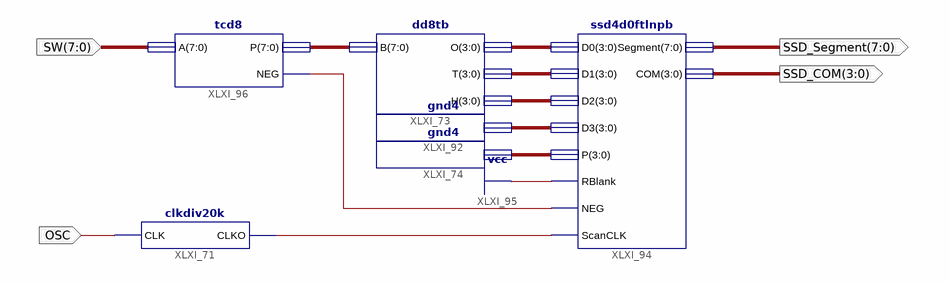
[diagram p0: schematic sheet 1]
// Xilinx ISE schematic main.sch (spartan6) as structural Verilog: 6 symbols, 4 ports
module main (
  input  OSC,
  input  [7:0] SW,
  output [3:0] SSD_COM,
  output [7:0] SSD_Segment
);

  wire XLXN_23, XLXN_28;
  wire [3:0] XLXN_1, XLXN_2, XLXN_3, XLXN_4, XLXN_5;
  wire [7:0] XLXN_27;

  dd8tb XLXI_73 (.B(XLXN_27), .H(XLXN_3), .O(XLXN_5), .T(XLXN_4));
  clkdiv20k XLXI_71 (.CLK(OSC), .CLKO(XLXN_23));
  gnd4 XLXI_74 (.GND(XLXN_2));
  gnd4 XLXI_92 (.GND(XLXN_1));
  ssd4d0ftlnpb XLXI_94 (
    .COM(SSD_COM), .D0(XLXN_5), .D1(XLXN_4), .D2(XLXN_3), .D3(XLXN_1), .NEG(XLXN_28), .P(XLXN_2),
    .RBlank(1'b1), .ScanCLK(XLXN_23), .Segment(SSD_Segment));
  tcd8 XLXI_96 (.A(SW), .NEG(XLXN_28), .P(XLXN_27));
endmodule
